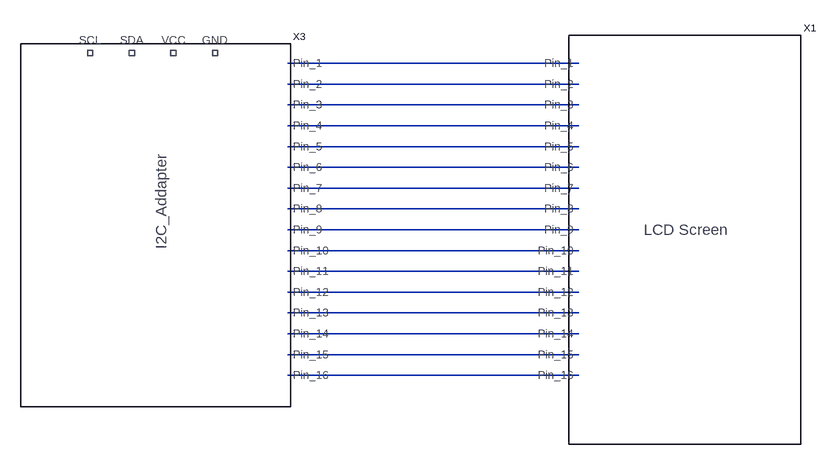
[diagram p0: schematic LCD_With_Adapter.asc]
LCD_With_Adapter.asc, the LTspice schematic file:
Version 4
SHEET 1 880 680
WIRE 192 -320 -256 -320
WIRE 192 -288 -256 -288
WIRE 192 -256 -256 -256
WIRE 192 -224 -256 -224
WIRE 192 -192 -256 -192
WIRE 192 -160 -256 -160
WIRE 192 -128 -256 -128
WIRE 192 -96 -256 -96
WIRE 192 -64 -256 -64
WIRE 192 -32 -256 -32
WIRE 192 0 -256 0
WIRE 192 32 -256 32
WIRE 192 64 -256 64
WIRE 192 96 -256 96
WIRE 192 128 -256 128
WIRE 192 160 -256 160
SYMBOL LCD\ Screen 464 16 R0
SYMATTR InstName X1
SYMBOL Final\ SDR\ schematics\ for\ SDD\ 4_28_19\\I2C_Adapter -560 -96 R0
SYMATTR InstName X3

The netlist it stands for:
* LCD_With_Adapter.asc
XX1 N001 N002 N003 N004 N005 N006 N007 N008 N009 N010 N011 N012 N013 N014 N015 N016 LCD Screen  ; pins Pin_1 Pin_2 Pin_3 Pin_4 Pin_5 Pin_6 Pin_7 Pin_8 Pin_9 Pin_10 Pin_11 Pin_12 Pin_13 Pin_14 Pin_15 Pin_16
XX3 NC_01 NC_02 NC_03 NC_04 N001 N002 N003 N004 N005 N006 N007 N008 N009 N010 N011 N012 N013 N014 N015 N016 I2C_Adapter  ; pins SCL SDA VCC GND Pin_1 Pin_2 Pin_3 Pin_4 Pin_5 Pin_6 Pin_7 Pin_8 Pin_9 Pin_10 Pin_11 Pin_12 Pin_13 Pin_14 Pin_15 Pin_16
.backanno
.end